# EAGLE design neopixel-heart (EAGLE 9.3.1)
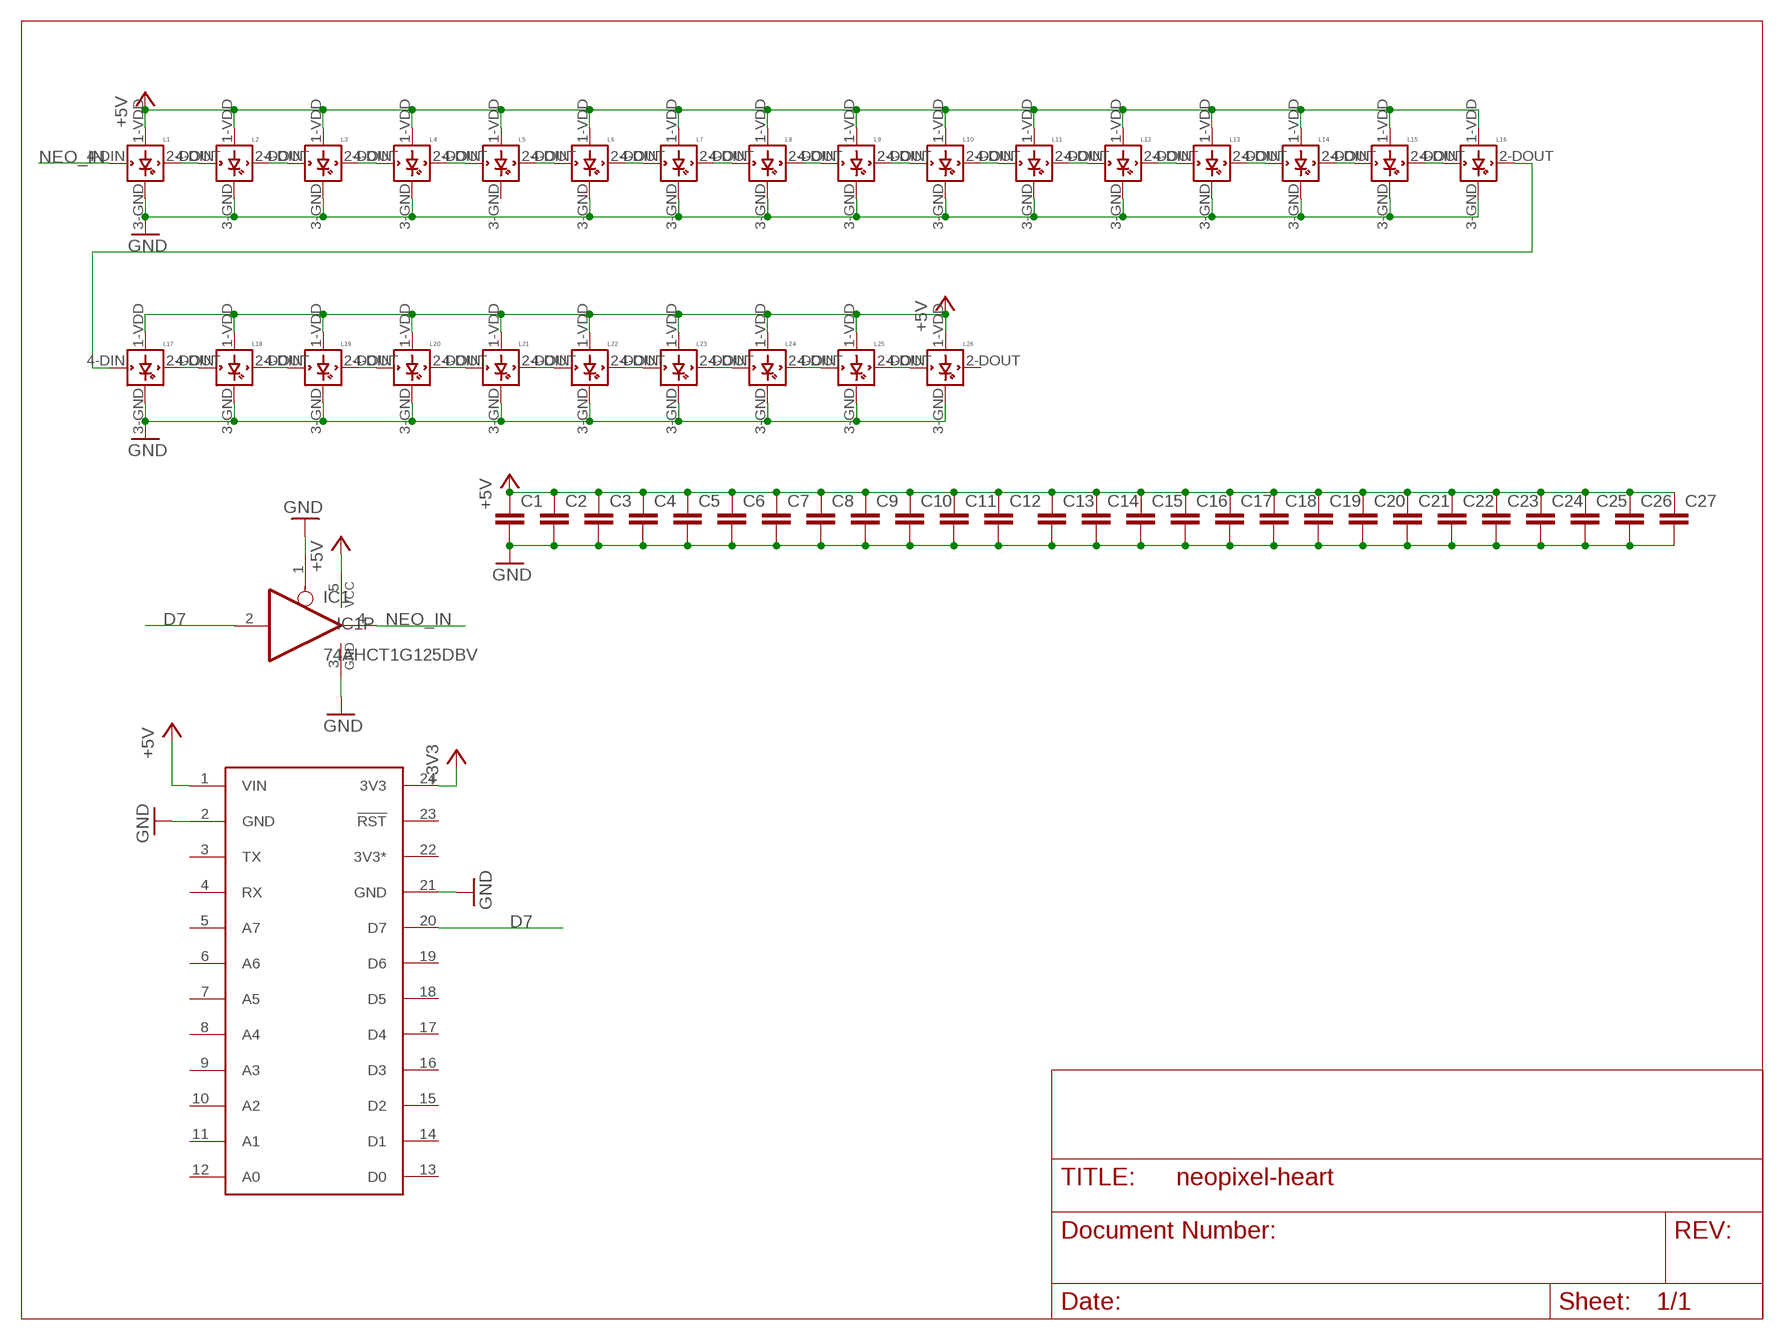
[diagram p0: schematic, sheet 1]

## Parts
C1  CAP0603-CAP  [0603-CAP]
C2  CAP0603-CAP  [0603-CAP]
C3  CAP0603-CAP  [0603-CAP]
C4  CAP0603-CAP  [0603-CAP]
C5  CAP0603-CAP  [0603-CAP]
C6  CAP0603-CAP  [0603-CAP]
C7  CAP0603-CAP  [0603-CAP]
C8  CAP0603-CAP  [0603-CAP]
C9  CAP0603-CAP  [0603-CAP]
C10  CAP0603-CAP  [0603-CAP]
C11  CAP0603-CAP  [0603-CAP]
C12  CAP0603-CAP  [0603-CAP]
C13  CAP0603-CAP  [0603-CAP]
C14  CAP0603-CAP  [0603-CAP]
C15  CAP0603-CAP  [0603-CAP]
C16  CAP0603-CAP  [0603-CAP]
C17  CAP0603-CAP  [0603-CAP]
C18  CAP0603-CAP  [0603-CAP]
C19  CAP0603-CAP  [0603-CAP]
C20  CAP0603-CAP  [0603-CAP]
C21  CAP0603-CAP  [0603-CAP]
C22  CAP0603-CAP  [0603-CAP]
C23  CAP0603-CAP  [0603-CAP]
C24  CAP0603-CAP  [0603-CAP]
C25  CAP0603-CAP  [0603-CAP]
C26  CAP0603-CAP  [0603-CAP]
C27  CAP0603-CAP  [0603-CAP]
IC1  74AHCT1G125DBV  [SOT23-5]
L1  WS2812B  [WS2812B]
L2  WS2812B  [WS2812B]
L3  WS2812B  [WS2812B]
L4  WS2812B  [WS2812B]
L5  WS2812B  [WS2812B]
L6  WS2812B  [WS2812B]
L7  WS2812B  [WS2812B]
L8  WS2812B  [WS2812B]
L9  WS2812B  [WS2812B]
L10  WS2812B  [WS2812B]
L11  WS2812B  [WS2812B]
L12  WS2812B  [WS2812B]
L13  WS2812B  [WS2812B]
L14  WS2812B  [WS2812B]
L15  WS2812B  [WS2812B]
L16  WS2812B  [WS2812B]
L17  WS2812B  [WS2812B]
L18  WS2812B  [WS2812B]
L19  WS2812B  [WS2812B]
L20  WS2812B  [WS2812B]
L21  WS2812B  [WS2812B]
L22  WS2812B  [WS2812B]
L23  WS2812B  [WS2812B]
L24  WS2812B  [WS2812B]
L25  WS2812B  [WS2812B]
L26  WS2812B  [WS2812B]
U$1  SPARK_CORECORE  [SPARK_CORE]

## Nets
+3V3: U$1.24(3V3)
+5V: C1.1 C2.1 C3.1 C4.1 C5.1 C6.1 C7.1 C8.1 C9.1 C10.1 C11.1 C12.1 C13.1 C14.1 C15.1 C16.1 C17.1 C18.1 C19.1 C20.1 C21.1 C22.1 C23.1 C24.1 C25.1 C26.1 C27.1 IC1.5(VCC) L1.1-VDD(VDD) L2.1-VDD(VDD) L3.1-VDD(VDD) L4.1-VDD(VDD) L5.1-VDD(VDD) L6.1-VDD(VDD) L7.1-VDD(VDD) L8.1-VDD(VDD) L9.1-VDD(VDD) L10.1-VDD(VDD) L11.1-VDD(VDD) L12.1-VDD(VDD) L13.1-VDD(VDD) L14.1-VDD(VDD) L15.1-VDD(VDD) L16.1-VDD(VDD) L17.1-VDD(VDD) L18.1-VDD(VDD) L19.1-VDD(VDD) L20.1-VDD(VDD) L21.1-VDD(VDD) L22.1-VDD(VDD) L23.1-VDD(VDD) L24.1-VDD(VDD) L25.1-VDD(VDD) L26.1-VDD(VDD) U$1.1(VIN)
D7: IC1.2(I) U$1.20(D7)
GND: C1.2 C2.2 C3.2 C4.2 C5.2 C6.2 C7.2 C8.2 C9.2 C10.2 C11.2 C12.2 C13.2 C14.2 C15.2 C16.2 C17.2 C18.2 C19.2 C20.2 C21.2 C22.2 C23.2 C24.2 C25.2 C26.2 C27.2 IC1.1(OE) IC1.3(GND) L1.3-GND(GND) L2.3-GND(GND) L3.3-GND(GND) L4.3-GND(GND) L6.3-GND(GND) L7.3-GND(GND) L8.3-GND(GND) L9.3-GND(GND) L10.3-GND(GND) L11.3-GND(GND) L12.3-GND(GND) L13.3-GND(GND) L14.3-GND(GND) L15.3-GND(GND) L16.3-GND(GND) L17.3-GND(GND) L18.3-GND(GND) L19.3-GND(GND) L20.3-GND(GND) L21.3-GND(GND) L22.3-GND(GND) L23.3-GND(GND) L24.3-GND(GND) L25.3-GND(GND) U$1.2(GND) U$1.21(GND)
N$1: L1.2-DOUT(DOUT) L2.4-DIN(DIN)
N$2: L2.2-DOUT(DOUT) L3.4-DIN(DIN)
N$3: L3.2-DOUT(DOUT) L4.4-DIN(DIN)
N$4: L4.2-DOUT(DOUT) L5.4-DIN(DIN)
N$5: L5.2-DOUT(DOUT) L6.4-DIN(DIN)
N$6: L6.2-DOUT(DOUT) L7.4-DIN(DIN)
N$7: L7.2-DOUT(DOUT) L8.4-DIN(DIN)
N$8: L8.2-DOUT(DOUT) L9.4-DIN(DIN)
N$9: L9.2-DOUT(DOUT) L10.4-DIN(DIN)
N$10: L10.2-DOUT(DOUT) L11.4-DIN(DIN)
N$11: L11.2-DOUT(DOUT) L12.4-DIN(DIN)
N$12: L12.2-DOUT(DOUT) L13.4-DIN(DIN)
N$13: L13.2-DOUT(DOUT) L14.4-DIN(DIN)
N$14: L14.2-DOUT(DOUT) L15.4-DIN(DIN)
N$15: L15.2-DOUT(DOUT) L16.4-DIN(DIN)
N$18: L17.2-DOUT(DOUT) L18.4-DIN(DIN)
N$19: L18.2-DOUT(DOUT) L19.4-DIN(DIN)
N$20: L19.2-DOUT(DOUT) L20.4-DIN(DIN)
N$21: L20.2-DOUT(DOUT) L21.4-DIN(DIN)
N$22: L21.2-DOUT(DOUT) L22.4-DIN(DIN)
N$23: L22.2-DOUT(DOUT) L23.4-DIN(DIN)
N$24: L23.2-DOUT(DOUT) L24.4-DIN(DIN)
N$25: L24.2-DOUT(DOUT) L25.4-DIN(DIN)
N$26: L25.2-DOUT(DOUT) L26.4-DIN(DIN)
N$29: L16.2-DOUT(DOUT) L17.4-DIN(DIN)
NEO_IN: IC1.4(O) L1.4-DIN(DIN)
Unconnected: L5.3-GND(GND) L26.2-DOUT(DOUT) L26.3-GND(GND) U$1.3(TX) U$1.4(RX) U$1.5(A7) U$1.6(A6) U$1.7(A5) U$1.8(A4) U$1.9(A3) U$1.10(A2) U$1.11(A1) U$1.12(A0) U$1.13(D0) U$1.14(D1) U$1.15(D2) U$1.16(D3) U$1.17(D4) U$1.18(D5) U$1.19(D6) U$1.23(!RST)

## Power pins joined to a net without a drawn wire
3V3*: U$1.22(3V3*)

## Library data of the parts
C1-C27 = SparkFun-Passives:CAP: Capacitor Standard 0603 ceramic capacitor, and 0.1" leaded capacitor.
IC1 = 74xx-little-us:74*1G125: Single Bus Buffer Gate with 3-State Output
L1-L26 = adafruit:WS2812B
U$1 = Spark:SPARK_CORE

## Board
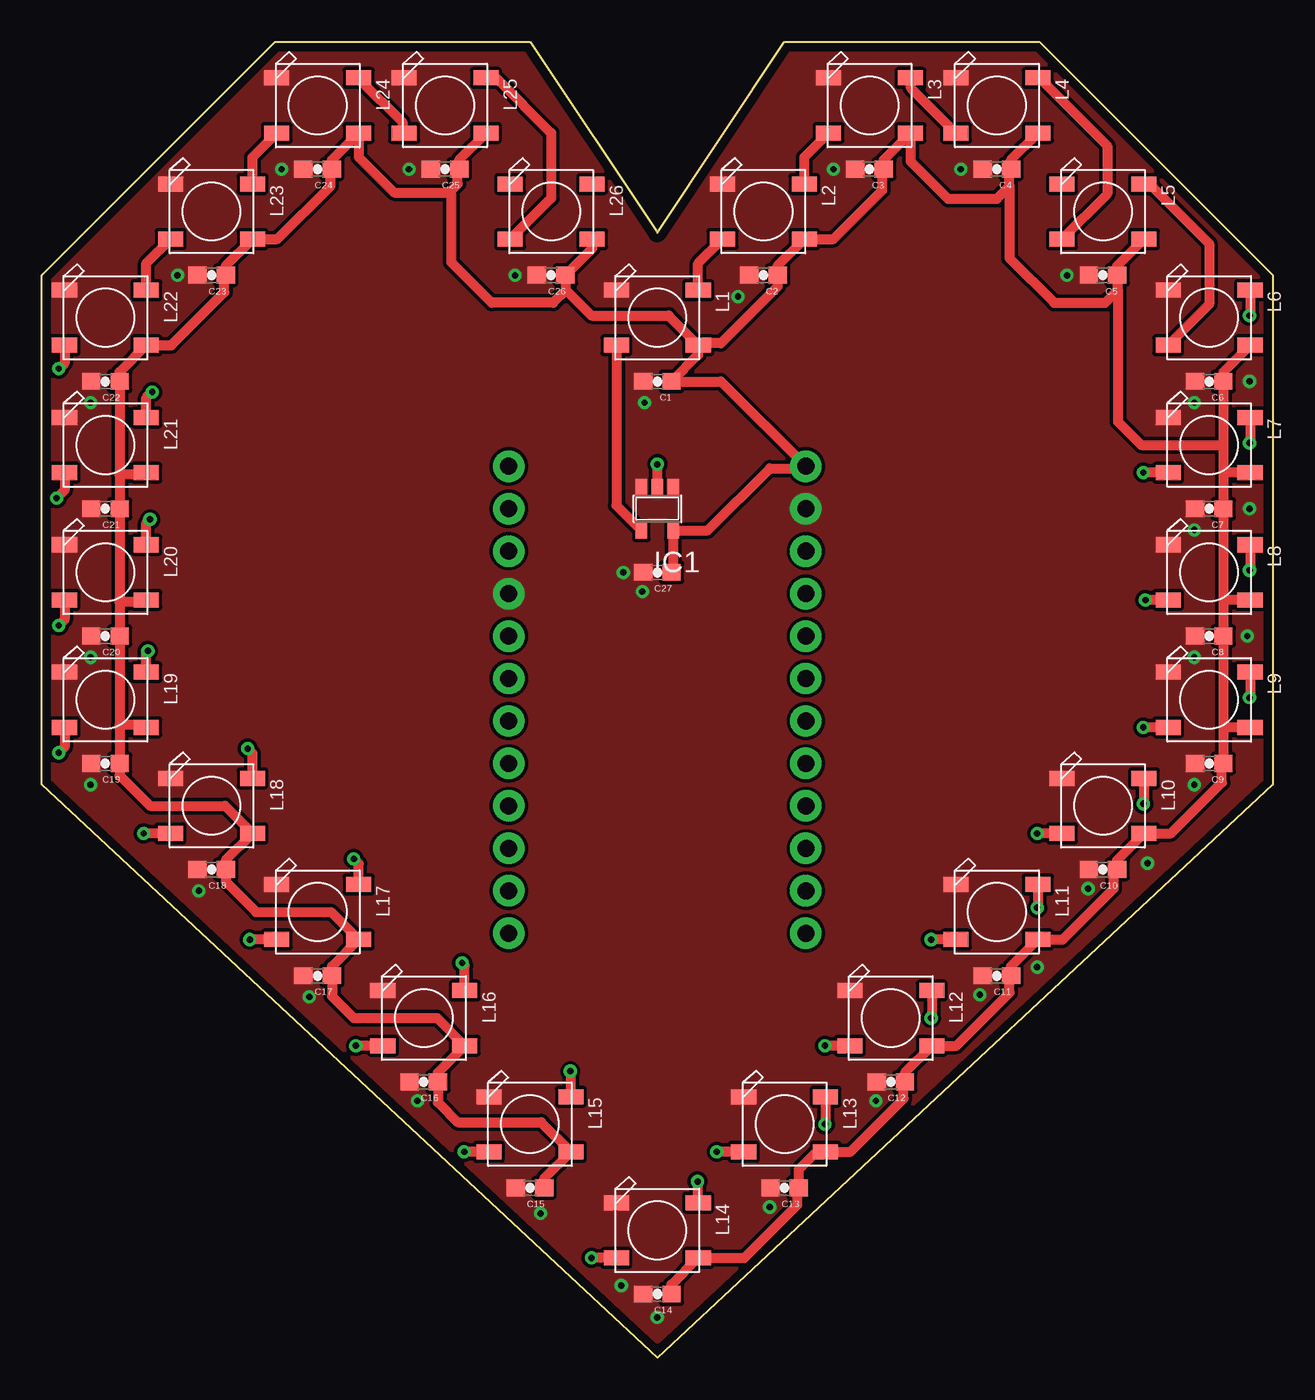
[diagram p1: board, top side]
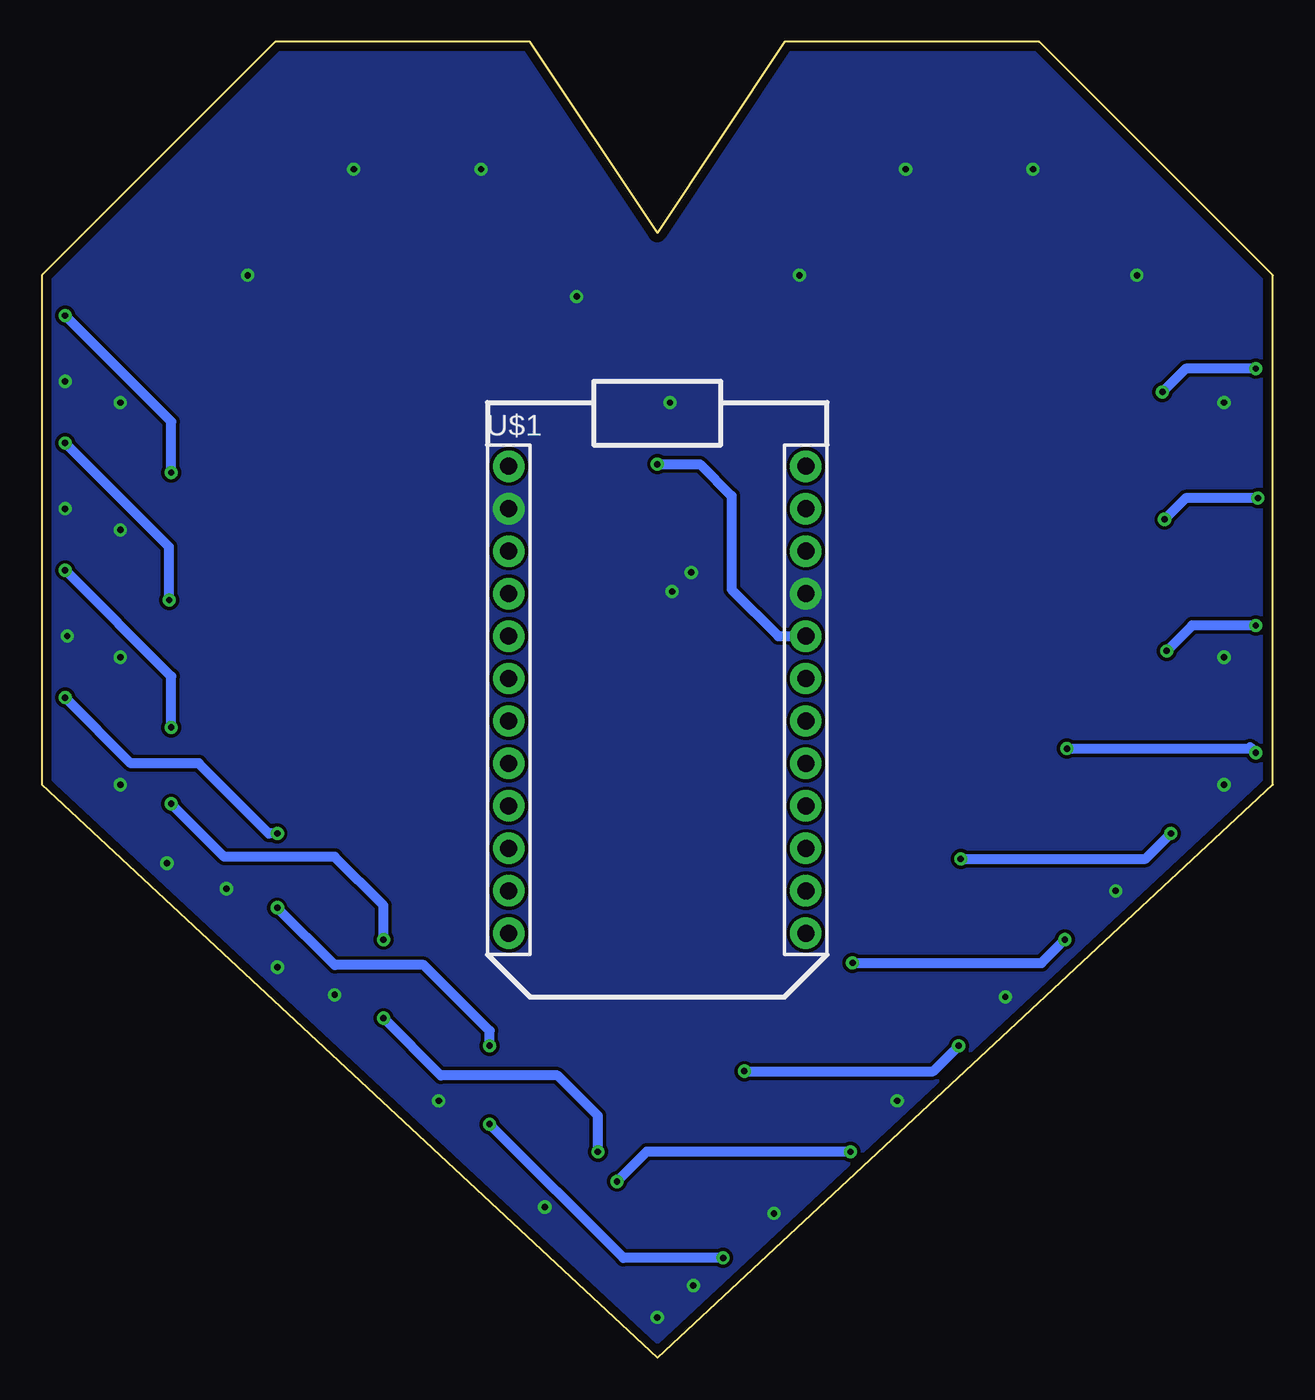
[diagram p2: board, bottom side, seen from below]

Size 73.66 x 78.74 mm. Coordinates in mm from the lower left corner, seen from the top.
Outline: 0,34.29 0,64.77 13.97,78.74 29.21,78.74 36.83,67.31 44.45,78.74 59.69,78.74 73.66,64.77 73.66,34.29 36.83,0 0,34.29
Copper layers (1*16): Top 0.035mm / dielectric 1.5mm / Bottom 0.035mm
Design rules "default *": minimum track width 10mil, minimum drill 24mil, track to track 8mil, track to pad 8mil, pad to pad 8mil, via to via 8mil, smd to smd 8mil, copper to edge 20mil, drill to drill 8mil, minimum pad ring 10mil, minimum via ring 8mil, stop-mask expansion 4mil, vias tented up to drill 0mil, thermal gap 10mil

### Footprints (pad centres in the part's own frame; a part is rotated, then mirrored left to right if it is on the bottom)
0603-CAP = smd 1.1 x 1: 1 -0.85,0; 2 0.85,0
SOT23-5 = smd 0.69 x 0.99: 1 -0.95,-1.29; 2 0,-1.29; 3 0.95,-1.29; 4 0.95,1.3; 5 -0.95,1.3
WS2812B = smd 1.5 x 0.9: 1-VDD 2.45,-1.65; 2-DOUT 2.45,1.65; 3-GND -2.45,1.65; 4-DIN -2.45,-1.65
SPARK_CORE = drill 1.016 pad 1.88: 1 -8.89,13.97; 2 -8.89,11.43; 3 -8.89,8.89; 4 -8.89,6.35; 5 -8.89,3.81; 6 -8.89,1.27; 7 -8.89,-1.27; 8 -8.89,-3.81; 9 -8.89,-6.35; 10 -8.89,-8.89; 11 -8.89,-11.43; 12 -8.89,-13.97; 13 8.89,-13.97; 14 8.89,-11.43; 15 8.89,-8.89; 16 8.89,-6.35; 17 8.89,-3.81; 18 8.89,-1.27; 19 8.89,1.27; 20 8.89,3.81; 21 8.89,6.35; 22 8.89,8.89; 23 8.89,11.43; 24 8.89,13.97

### Placement (x,y rotation side)
C1  36.83,58.42 180 top
C2  43.18,64.77 180 top
C3  49.53,71.12 180 top
C4  57.15,71.12 180 top
C5  63.5,64.77 180 top
C6  69.85,58.42 180 top
C7  69.85,50.8 180 top
C8  69.85,43.18 180 top
C9  69.85,35.56 180 top
C10  63.5,29.21 180 top
C11  57.15,22.86 180 top
C12  50.8,16.51 180 top
C13  44.45,10.16 180 top
C14  36.83,3.81 180 top
C15  29.21,10.16 180 top
C16  22.86,16.51 180 top
C17  16.51,22.86 180 top
C18  10.16,29.21 180 top
C19  3.81,35.56 180 top
C20  3.81,43.18 180 top
C21  3.81,50.8 180 top
C22  3.81,58.42 180 top
C23  10.16,64.77 180 top
C24  16.51,71.12 180 top
C25  24.13,71.12 180 top
C26  30.48,64.77 180 top
C27  36.83,46.99 180 top
IC1  36.83,50.8 180 top
L1  36.83,62.23 0 top
L2  43.18,68.58 0 top
L3  49.53,74.93 0 top
L4  57.15,74.93 0 top
L5  63.5,68.58 0 top
L6  69.85,62.23 0 top
L7  69.85,54.61 0 top
L8  69.85,46.99 0 top
L9  69.85,39.37 0 top
L10  63.5,33.02 0 top
L11  57.15,26.67 0 top
L12  50.8,20.32 0 top
L13  44.45,13.97 0 top
L14  36.83,7.62 0 top
L15  29.21,13.97 0 top
L16  22.86,20.32 0 top
L17  16.51,26.67 0 top
L18  10.16,33.02 0 top
L19  3.81,39.37 0 top
L20  3.81,46.99 0 top
L21  3.81,54.61 0 top
L22  3.81,62.23 0 top
L23  10.16,68.58 0 top
L24  16.51,74.93 0 top
L25  24.13,74.93 0 top
L26  30.48,68.58 0 top
U$1  36.83,39.37 0 bottom

### Tracks (layer width: path | path; a pad name or v marks a point on that pad's centre or on a via)
+5V
  Top 0.61: 70.7,54.74 C6.1 70.7,58.98 L6.1-VDD | 70.7,54.74 70.7,53.09 | 70.7,53.09 C7.1 70.7,45.21 | 70.7,45.21 C8.1 70.7,37.85 | 70.7,37.85 C9.1 70.61,35.47 70.61,34.42 67.56,31.37 L10.1-VDD 64.35,29.77 C10.1 64.14,29 64.14,28.07 61.09,25.02 L11.1-VDD 58,23.42 C11.1 57.91,22.77 57.91,21.84 54.74,18.67 L12.1-VDD 51.65,17.07 C12.1 51.56,16.42 51.56,15.49 48.39,12.32 L13.1-VDD 46.77,12.19 46.23,12.19 45.3,11.26 C13.1 45.21,10.07 45.21,9.14 42.04,5.97 L14.1-VDD 37.68,4.37 C14.1 | 4.66,52.83 C22.1 4.66,58.98 L22.1-VDD 7.75,60.58 10.92,63.75 10.92,64.68 C23.1 11.01,65.33 L23.1-VDD 14.1,66.93 17.27,70.1 17.27,71.03 C24.1 17.36,71.68 L24.1-VDD 18.96,71.84 21.08,69.72 24.38,69.72 | 4.66,52.83 C21.1 4.66,45.21 | 4.66,45.21 C20.1 4.66,37.85 | 4.66,37.85 C19.1 4.66,34.84 6.48,33.02 10.96,33.02 L18.1-VDD 11.01,29.77 C18.1 11.01,28.49 12.83,26.67 17.31,26.67 L17.1-VDD 17.36,23.42 C17.1 17.36,21.63 18.67,20.32 23.66,20.32 L16.1-VDD 23.71,17.07 C16.1 23.71,15.28 24.89,14.1 29.88,14.1 L15.1-VDD 30.06,10.72 C15.1 | L19.1-VDD 6.13,37.85 4.66,37.85 | L20.1-VDD 6.13,45.21 4.66,45.21 | L21.1-VDD 6.13,52.83 4.66,52.83 | L26.1-VDD 32.93,66.37 C26.1 31.33,63.84 | L1.1-VDD 39.28,60.02 C1.1 40.64,58.42 U$1.1 45.59,53.21 43.56,53.21 39.85,49.5 IC1.5 37.78,47.09 C27.1 | L1.1-VDD 39.41,60.71 40.64,60.71 44.03,64.1 C2.1 44.03,65.33 L2.1-VDD 47.37,66.93 50.29,69.85 50.29,71.03 C3.1 50.38,71.68 L3.1-VDD 51.98,71.59 54.23,69.34 57.15,69.34 57.91,70.1 | L4.1-VDD 58,71.68 C4.1 57.91,71.03 57.91,70.1 | L5.1-VDD 64.35,65.33 C5.1 64.39,64.73 64.39,63.88 | L9.1-VDD 70.83,37.72 70.7,37.85
  Top 0.61: L8.1-VDD 70.83,45.34 70.7,45.21 | L7.1-VDD 70.83,52.96 70.7,53.09 | L25.1-VDD 24.98,71.68 C25.1 24.89,71.03 24.89,70.23 24.38,69.72 | 57.91,70.1 57.91,65.79 60.58,63.12 63.63,63.12 64.39,63.88 | 31.33,63.84 30.61,63.12 26.92,63.12 24.51,65.53 24.51,69.6 24.38,69.72 | 31.33,63.84 31.41,63.84 32.89,62.36 37.5,62.36 L1.1-VDD | 64.39,63.88 64.39,56.01 65.79,54.61 70.57,54.61 70.7,54.74
D7  (via drill 0.38)
  Top 0.61: IC1.2 v36.83,53.47
  Bottom 0.61: v36.83,53.47 34.29,53.47 32.38,51.56 32.38,45.97 29.59,43.18 U$1.20
GND  (via drill 0.38)
  other vias: 2.92,41.91 2.92,34.29 9.4,27.94 16,21.59 22.48,15.37 29.84,8.64 36.83,2.41 34.67,4.32 43.56,9.02 49.91,15.37 56.13,21.72 62.61,28.07 68.96,34.29 68.96,41.91 68.96,49.53 68.96,57.15 61.34,64.77 54.99,71.12 47.37,71.12 41.66,63.5 36.07,57.15 28.32,64.77 21.97,71.12 14.35,71.12 8.13,64.77 2.92,57.15 34.8,46.99 35.94,45.85 66.17,29.59 59.56,23.37 72.14,43.18 72.26,58.42 72.26,50.8
  pour Bottom (no thermals): 0,0 0,78.74 73.66,78.74 73.66,0
  pour Top (no thermals): 0,1.27 0,78.74 73.66,78.74 73.66,0 0,0
N$1
  Top 0.61: L1.2-DOUT 39.28,65.48 L2.4-DIN
N$2
  Top 0.61: L2.2-DOUT 45.63,71.83 L3.4-DIN
N$3
  Top 0.61: L3.2-DOUT 51.98,76 L4.4-DIN
N$4
  Top 0.61: L4.2-DOUT 59.69,76.58 63.75,72.52 63.75,69.63 L5.4-DIN
N$5
  Top 0.61: L5.2-DOUT 66.3,70.23 69.85,66.67 69.85,63.03 L6.4-DIN
N$6  (via drill 0.38)
  Top 0.61: L6.2-DOUT 72.3,62.39 v72.26,62.36 | L7.4-DIN v65.91,52.96
  Bottom 0.61: v65.91,52.96 65.91,56.01 v72.26,62.36
N$7  (via drill 0.38)
  Top 0.61: L7.2-DOUT 72.3,54.77 v72.26,54.74 | L8.4-DIN v66.04,45.34
  Bottom 0.61: v66.04,45.34 66.04,48.51 v72.26,54.74
N$8  (via drill 0.38)
  Top 0.61: L8.2-DOUT 72.3,47.15 v72.26,47.12 | L9.4-DIN v65.91,37.72
  Bottom 0.61: v65.91,37.72 65.91,40.77 v72.26,47.12
N$9  (via drill 0.38)
  Top 0.61: L9.2-DOUT 72.3,39.53 v72.26,39.5 | L10.4-DIN v59.56,31.37
  Bottom 0.61: v59.56,31.37 60.07,31.37 64.26,35.56 68.33,35.56 v72.26,39.5
N$10  (via drill 0.38)
  Top 0.61: L10.2-DOUT 65.95,33.18 v65.91,33.15 | L11.4-DIN v53.21,25.02
  Bottom 0.61: v53.21,25.02 53.21,27.05 56.13,29.97 62.74,29.97 v65.91,33.15
N$11  (via drill 0.38)
  Top 0.61: L11.2-DOUT 59.6,26.96 v59.56,26.92 | L12.4-DIN v46.86,18.67
  Bottom 0.61: v46.86,18.67 46.86,19.56 50.8,23.5 56.13,23.5 v59.56,26.92
N$12  (via drill 0.38)
  Top 0.61: L12.2-DOUT 53.25,20.36 v53.21,20.32 | L13.4-DIN v40.39,12.32
  Bottom 0.61: v40.39,12.32 40.39,14.48 42.8,16.89 49.78,16.89 v53.21,20.32
N$13  (via drill 0.38)
  Top 0.61: L13.2-DOUT 46.9,14.01 v46.86,13.97 | L14.4-DIN v32.89,5.97
  Bottom 0.61: v32.89,5.97 38.86,5.97 v46.86,13.97
N$14  (via drill 0.38)
  Top 0.61: L14.2-DOUT 39.28,10.5 v39.24,10.54 | L15.4-DIN v25.27,12.32
  Bottom 0.61: v25.27,12.32 37.47,12.32 v39.24,10.54
N$15  (via drill 0.38)
  Top 0.61: L15.2-DOUT 31.66,17.11 v31.62,17.14 | L16.4-DIN v18.8,18.67
  Bottom 0.61: v31.62,17.14 20.32,17.14 v18.8,18.67
N$18  (via drill 0.38)
  Top 0.61: L17.2-DOUT 18.96,29.55 v18.67,29.84 | L18.4-DIN v6.1,31.37
  Bottom 0.61: v18.67,29.84 7.62,29.84 v6.1,31.37
N$19  (via drill 0.38)
  Top 0.61: L18.2-DOUT 12.61,36.16 v12.32,36.45 | L19.4-DIN 1.36,36.54 v1.02,36.2
  Bottom 0.61: v12.32,36.45 1.45,36.45 1.36,36.54 v1.02,36.2
N$20  (via drill 0.38)
  Top 0.61: L19.2-DOUT 6.26,42.2 v6.35,42.29 | L20.4-DIN 1.36,44.16 v1.02,43.81
  Bottom 0.61: v1.02,43.81 4.83,43.81 v6.35,42.29
N$21  (via drill 0.38)
  Top 0.61: L20.2-DOUT 6.26,49.95 v6.48,50.16 | L21.4-DIN 1.36,51.91 v0.89,51.44
  Bottom 0.61: v0.89,51.44 5.21,51.44 v6.48,50.16
N$22  (via drill 0.38)
  Top 0.61: L21.2-DOUT 6.26,57.44 v6.6,57.78 | L22.4-DIN 1.36,59.53 v1.02,59.18
  Bottom 0.61: v1.02,59.18 5.21,59.18 v6.6,57.78
N$23
  Top 0.61: L22.2-DOUT 6.26,65.48 L23.4-DIN
N$24
  Top 0.61: L23.2-DOUT 12.61,71.83 L24.4-DIN
N$25
  Top 0.61: L24.2-DOUT 18.96,76.54 21.59,73.91 21.59,73.37 L25.4-DIN
N$26
  Top 0.61: L25.2-DOUT 27.18,76.58 30.48,73.28 30.48,69.38 L26.4-DIN
N$29  (via drill 0.38)
  Top 0.61: L16.2-DOUT 25.31,23.46 v25.15,23.62 | L17.4-DIN v12.45,25.02
  Bottom 0.61: v25.15,23.62 13.84,23.62 v12.45,25.02
NEO_IN
  Top 0.61: L1.4-DIN 34.38,51 IC1.4